# Altium schematic sheet BaseDimmerBoard.SchDoc
size 420 x 297 mm; TechControlBy: {Т.контроль}; StandartControlBy: {Н.котроль}; Letter1: {Э}; DocumentType: Схема электрическая принципиальная; Title1: {Наименование}; Title2: {Наименование}; GroupNumber: {XXXX.000000.001-01}; Title3: {Наименование}; PageSetup: Record=PageOptions|CenterHorizontal=True|CenterVertical=True|PrintScale=0.95|XCorrection=1.00|YCorrection=1.00|PrintKind=2|BorderSize=5000000|LeftOffset=0|BottomOffset=0|Orientation=1|PaperLength=1000|PaperWidth=1000|Scale=100|PaperSource=7|PrintQuality=-3|MediaType=1|DitherType=10|PrintScaleMode=1|PaperKind=A4|PaperIndex=9; DocumentNumber: 1; SheetTotal: 1
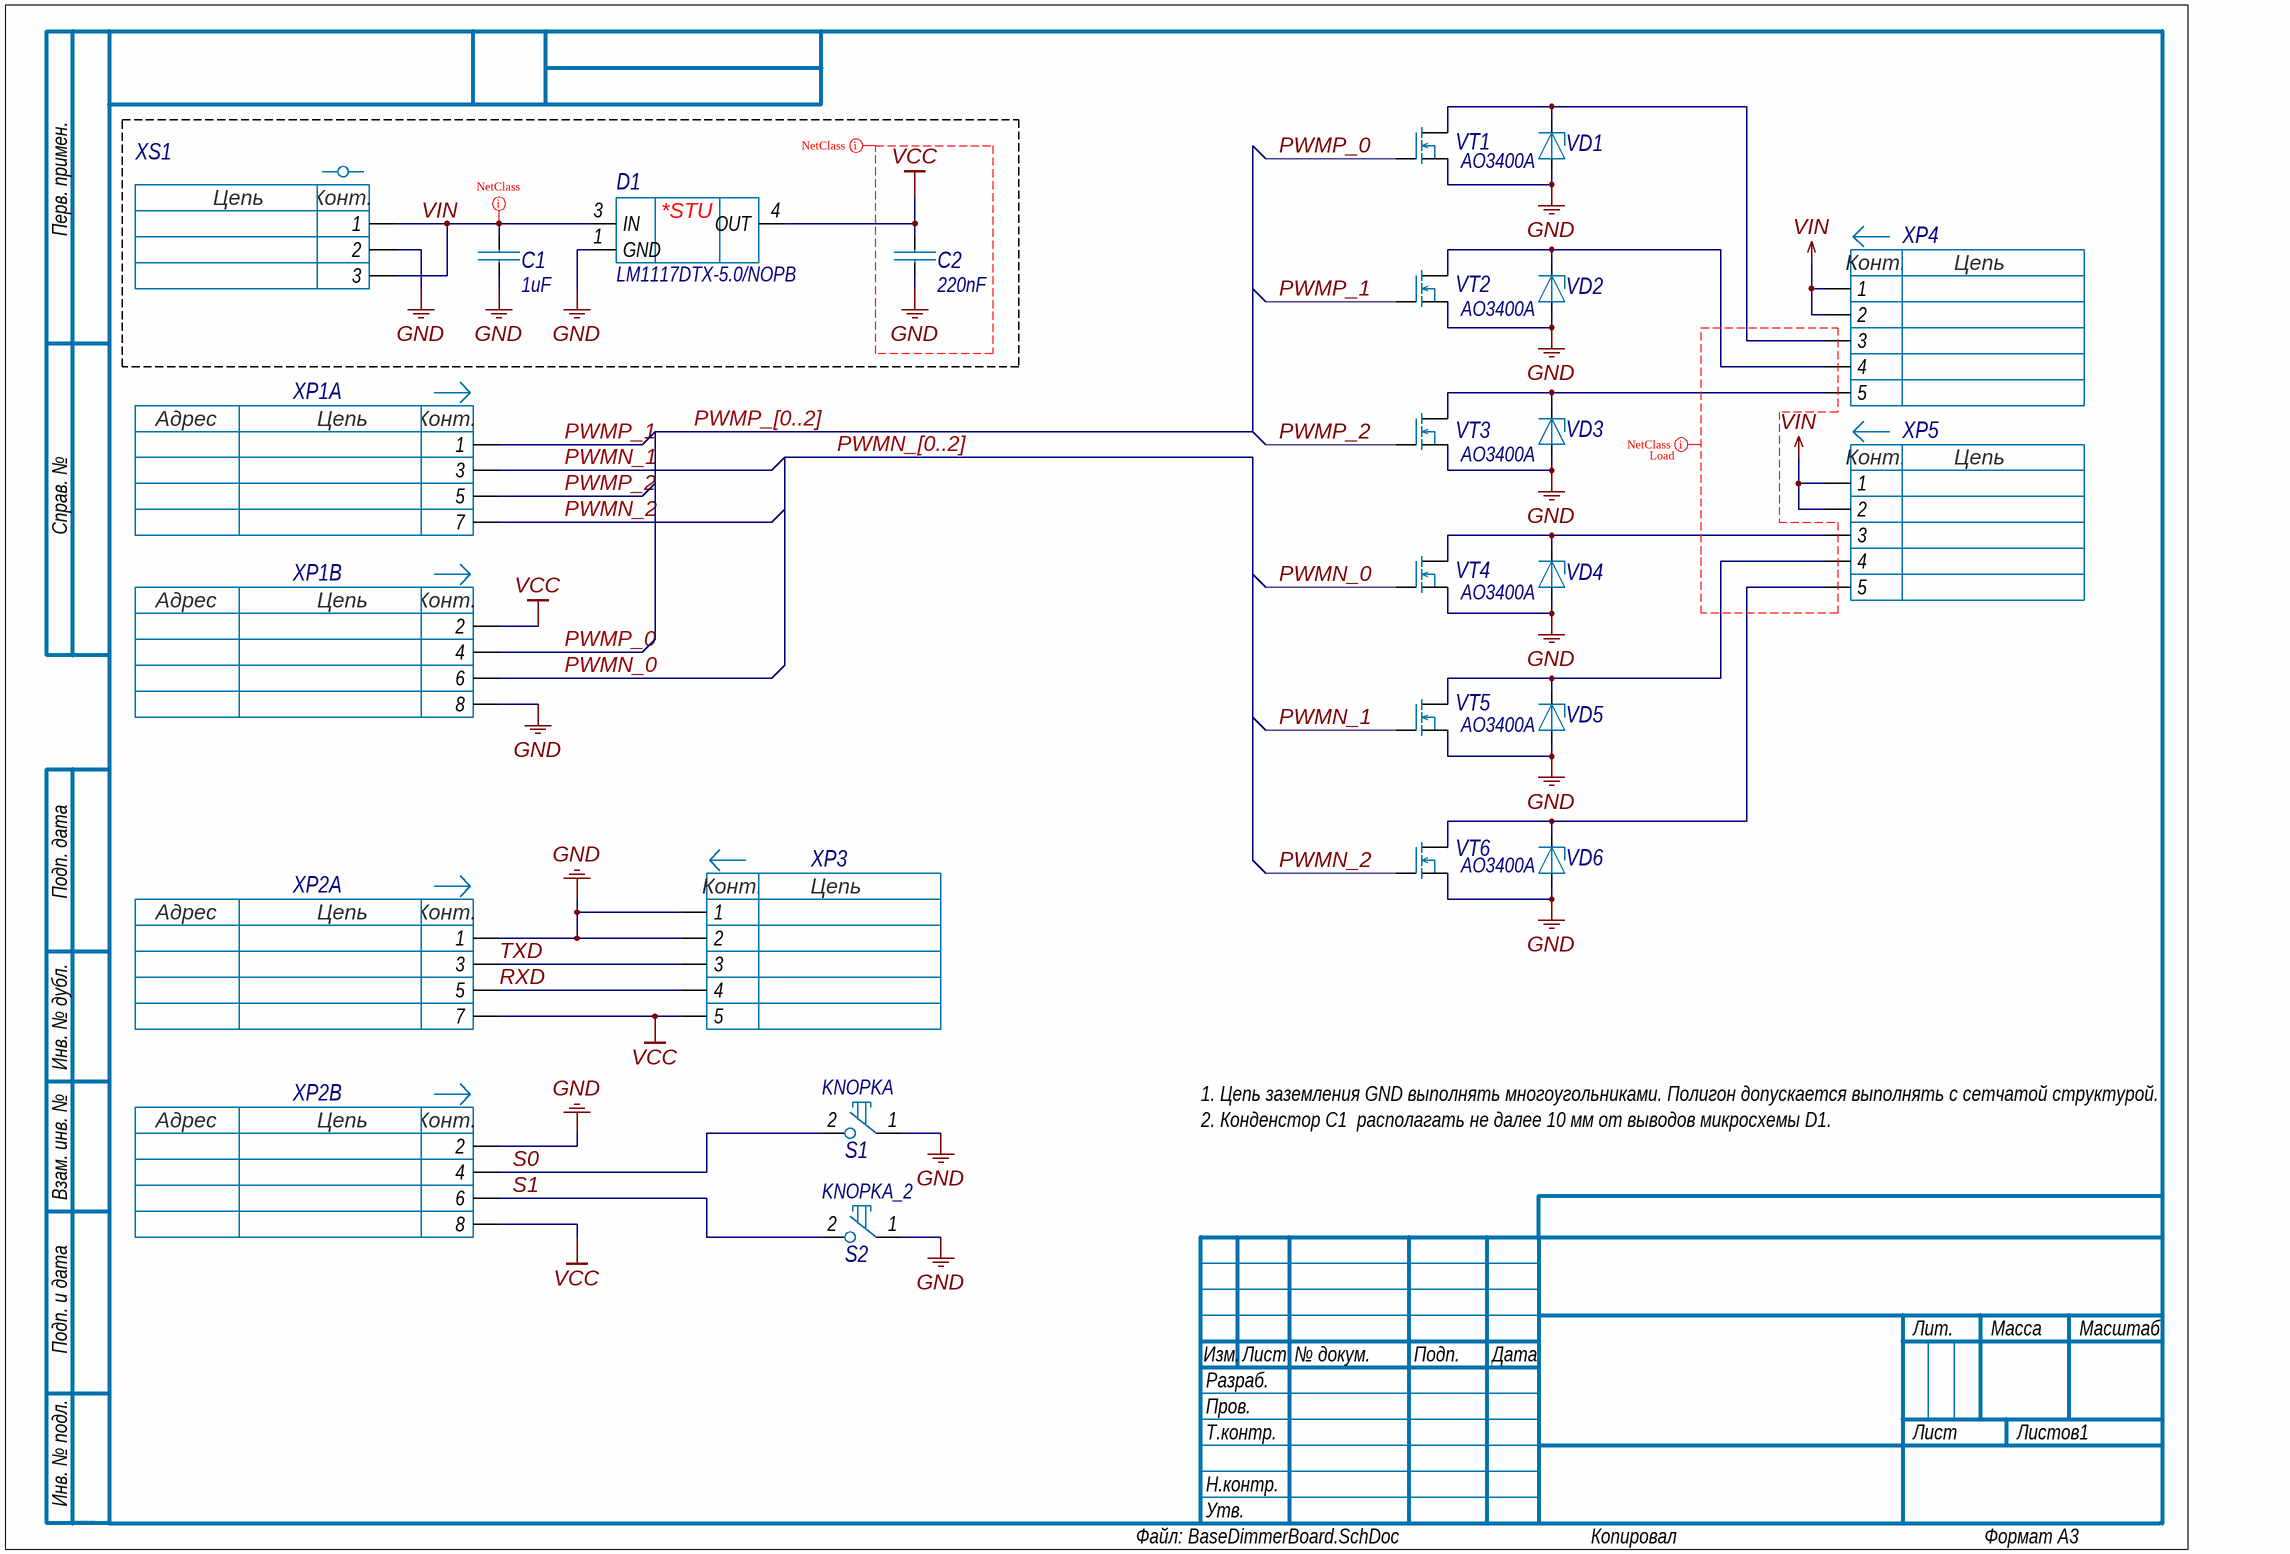
[diagram p0: BaseDimmerBoard.SchDoc]

## Parts
C1  value 1uF  [CAPC1825(4564)220_N]  (hidden comment: 1825 1 uF 25 V ±10 %  X7R)
C2  value 220nF  [CAPC0805(2012)100_N]  (hidden comment: 220nF 6.3V 0805(2012))
D1  LM1117DTX-5.0/NOPB  [NDP0003B_L]
S1  KNOPKA  [ELASTO_5.08MM]
S2  KNOPKA_2  [DOME_SQ04200N]
VD1  P6SMB27AT3G  [ONSC-SMB-2-403A-03_J_V]  (value not drawn)
VD2  P6SMB27AT3G  [ONSC-SMB-2-403A-03_J_V]  (value not drawn)
VD3  P6SMB27AT3G  [ONSC-SMB-2-403A-03_J_V]  (value not drawn)
VD4  P6SMB27AT3G  [ONSC-SMB-2-403A-03_J_V]  (value not drawn)
VD5  P6SMB27AT3G  [ONSC-SMB-2-403A-03_J_V]  (value not drawn)
VD6  P6SMB27AT3G  [ONSC-SMB-2-403A-03_J_V]  (value not drawn)
VT1  AO3400A  [AO-SOT23-3_V]
VT2  AO3400A  [AO-SOT23-3_V]
VT3  AO3400A  [AO-SOT23-3_V]
VT4  AO3400A  [AO-SOT23-3_V]
VT5  AO3400A  [AO-SOT23-3_V]
VT6  AO3400A  [AO-SOT23-3_V]
XP1  TSM-104-04-T-DV  [TSM-104-04-T-DV]  (value not drawn)  (parts A,B of 2)
XP2  TSM-104-04-T-DV  [TSM-104-04-T-DV]  (value not drawn)  (parts A,B of 2)
XP3  TSW-105-05-T-S  [SMTC-TSW-105-05-X-S]  (value not drawn)
XP4  TSW-105-05-T-S  [SMTC-TSW-105-05-X-S]  (value not drawn)
XP5  TSW-105-05-T-S  [SMTC-TSW-105-05-X-S]  (value not drawn)
XS1  691213710003  [ETB15-3]  (value not drawn)

## Nets
GND: C1.2 C2.1 D1.1(GND) S1.1 S2.1 VD1.2 VD2.2 VD3.2 VD4.2 VD5.2 VD6.2 VT1.S VT2.S VT3.S VT4.S VT5.S VT6.S XP1.8 XP2.1 XP2.2 XP3.1 XP3.2 XS1.2
VCC: C2.2 D1.4(OUT) XP1.2 XP2.7 XP2.8 XP3.5
VIN: C1.1 D1.3(IN) XP4.1 XP4.2 XP5.1 XP5.2 XS1.1 XS1.3
PWMN_0: VT4.G XP1.6
PWMN_1: VT5.G XP1.3
PWMN_2: VT6.G XP1.7
PWMP_0: VT1.G XP1.4
PWMP_1: VT2.G XP1.1
PWMP_2: VT3.G XP1.5
RXD: XP2.5 XP3.4
S0: S1.2 XP2.4
S1: S2.2 XP2.6
TXD: XP2.3 XP3.3
NetVD1_1: VD1.1 VT1.D XP4.3
NetVD2_1: VD2.1 VT2.D XP4.4
NetVD3_1: VD3.1 VT3.D XP4.5
NetVD4_1: VD4.1 VT4.D XP5.3
NetVD5_1: VD5.1 VT5.D XP5.4
NetVD6_1: VD6.1 VT6.D XP5.5

## Buses and harness runs
bus PWMN_[0..2]
bus PWMP_[0..2]

## Layout directives
net class Power: GND, VCC, VIN
net class Load: VIN

## Notes on the sheet
- Функциональная группа стабилизатора напряжения
- 1. Цепь заземления GND выполнять многоугольниками. Полигон допускается выполнять с сетчатой структурой.
- 2. Конденстор C1  располагать не далее 10 мм от выводов микросхемы D1.
- Перв. примен.
- Справ. №
- Подп. дата
- Инв. № дубл.
- Взам. инв. №
- Подп. и дата
- Изм.
- Разраб.
- Лист
- № докум.
- Подп.
- Дата
- Лит.
- Масса
- Масштаб
- Пров.
- Т.контр.
- Листов
- Инв. № подл.
- Н.контр.
- Утв.
- ALTIUM GOSTBOM2.0 KEV
- Файл:
- Копировал
- Формат А3
- (in symbol 691213710003) Цепь; Конт.
- (in symbol LM1117DTX-5.0/NOPB) *STU
- (in symbol TSM-104-04-T-DV, part A) Адрес; Цепь; Конт.
- (in symbol TSM-104-04-T-DV, part B) Адрес; Цепь; Конт.
- (in symbol TSW-105-05-T-S) Конт.; Цепь

## Library data of the parts
C1 = VJ1825Y105KXXAT: Керамический чип-конденсатор; Manufacturer: Vishay; Tolerance: 10%; Voltage Rating (DC): 25V; Mount: Surface Mount; Case/Package: 1825; Min Operating Temperature: -55°C; Max Operating Temperature: 150°C; Dielectric: X7R; Voltage Rating: 25V; Length: 4.5mm; Depth: 6.4mm; Lead Free: Lead Free; ComponentLink2URL: http://datasheet.octopart.com/VJ1825Y105KXXAT-Vishay-datasheet-14932079.pdf; ComponentLink2Description: http://datasheet.octopart.com/VJ1825Y105KXXAT-Vishay-datasheet-14932079.pdf; Stock 1: 0; Supplier 1: Avnet; Supplier Part Number 1: VJ1825Y105KXXAT; ClassName: Stabilizer; Manufacturer Part Number: VJ1825Y105KXXAT
C2 = LLM215R70J224MA11L: Керамический чип-конденсатор; Manufacturer: Murata; Tolerance: 20%; Dielectric: X7R; Mount: Surface Mount; Case/Package: 0805; Case Code (Metric): 2012; Case Code (Imperial): 0805; Min Operating Temperature: -55°C; Max Operating Temperature: 125°C; Package Quantity: 1; Voltage Rating: 6.3V; Packaging: Tape and Reel; Termination: SMD/SMT; Voltage Rating (DC): 6.3V; Length: 2mm; Height: 0.5mm; Width: 0.049inch; Thickness: 0.022inch; Depth: 1.25mm; Radiation Hardening: No; Lead Free: Lead Free; ComponentLink9URL: http://datasheet.octopart.com/LLM215R70J224MA11L-Murata-datasheet-11978611.pdf; ComponentLink9Description: http://datasheet.octopart.com/LLM215R70J224MA11L-Murata-datasheet-11978611.pdf; Stock 1: 3598; Supplier 1: Mouser; Supplier Part Number 1: 81-LLM215R70J224MA1L; ClassName: Stabilizer; Manufacturer Part Number: LLM215R70J224MA11L
D1 = LM1117DTX-5.0/NOPB: LDO Regulator Pos 5V 0.8A 3-Pin(2+Tab) TO-252 T/R; Manufacturer: TI National Semiconductor; Quiescent Current: 10mA; Dropout Voltage: 1.2V; Max Input Voltage: 15V; Output Current: 800mA; Number of Outputs: 1; Polarity: Positive; Output Type: Fixed; Accuracy: 1%; Mount: Surface Mount; Case/Package: TO-252; Number of Pins: 3; Contact Plating: Tin; Min Operating Temperature: -40°C; Max Operating Temperature: 125°C; Output Voltage: 5V; Packaging: Tape and Reel; Max Output Current: 800mA; Package Quantity: 2500; Number of Regulators: 1; Min Current Limit: 800mA; Nominal Output Voltage: 5V; Output Voltage Accuracy: 1%; Radiation Hardening: No; Lead Free: Lead Free; REACH SVHC: No SVHC; ComponentLink1URL: https://datasheet.ciiva.com/39121/1280534-39121523.pdf?src-supplier=Jameco; ComponentLink1Description: https://datasheet.ciiva.com/39121/1280534-39121523.pdf?src-supplier=Jameco; Stock 1: 2500; Supplier 1: Arrow; Supplier Part Number 1: LM1117DTX-5.0/NOPB; Manufacturer Part Number: LM1117DTX-5.0/NOPB; ClassName: Stabilizer
S1 = KNOPKA: Manufacturer Part Number: Сенсор
S2 = KNOPKA_2: Manufacturer Part Number: Сенсор
VD1-VD6 = P6SMB27AT3G: TVS DIODE 23.1V 37.5V SMB; Manufacturer: ON Semiconductor; Breakdown Voltage: 27V; Max Surge Current: 16A; Reverse Breakdown Voltage: 25.7V; Number of Elements: 1; Direction: Unidirectional; Peak Pulse Power: 600W; Power Line Protection: No; Max Reverse Leakage Current: 5uA; Test Current: 1mA; ESD Protection: Yes; Element Configuration: Single; Max Breakdown Voltage: 28.4V; Case/Package: SMB; Number of Pins: 2; Contact Plating: Tin; Min Operating Temperature: -65°C; Max Operating Temperature: 150°C; Packaging: Tape and Reel; Package Quantity: 1; Operating Supply Voltage: 23.1V; Clamping Voltage: 37.5V; Polarity: Unidirectional; Number of Unidirectional Channels: 1; Reverse Standoff Voltage: 23.1V; Min Breakdown Voltage: 25.7V; Peak Pulse Current: 16A; Leakage Current: 5uA; Power Dissipation: 600W; Voltage Rating (DC): 27V; Current Rating: 16A; Composition: Zener; Number of Channels: 1; Termination: SMD/SMT; Length: 4.32mm; Height: 2.13mm; Width: 3.56mm; Depth: 3.56mm; Radiation Hardening: No; Lead Free: Lead Free; REACH SVHC: No SVHC; ComponentLink1URL: https://datasheet.ciiva.com/3021/p6smb6-8at3-d-3021361.pdf?src-supplier=Avnet; ComponentLink1Description: https://datasheet.ciiva.com/3021/p6smb6-8at3-d-3021361.pdf?src-supplier=Avnet; Stock 1: 0; Supplier 1: Avnet; Supplier Part Number 1: P6SMB27AT3G; Manufacturer Part Number: P6SMB27AT3G
VT1-VT6 = AO3400A: MOSFET N-CH 30V 5.7A SOT23; Manufacturer: Alpha & Omega Semiconductor; Gate to Source Voltage (Vgs): 12V; Rds On Max: 26.5mR; Input Capacitance: 630pF; Max Power Dissipation: 1.4W; Number of Elements: 1; Mount: Surface Mount; Case/Package: SOT-23; Number of Pins: 3; Min Operating Temperature: -55°C; Max Operating Temperature: 150°C; Packaging: Tape and Reel; Drain to Source Voltage (Vdss): 30V; Continuous Drain Current (ID): 5.7A; Power Dissipation: 1.4W; Radiation Hardening: No; Lead Free: Lead Free; ComponentLink1URL: https://datasheet.ciiva.com/940/ao3400a-940739.pdf?src-supplier=Digi-Key; ComponentLink1Description: https://datasheet.ciiva.com/940/ao3400a-940739.pdf?src-supplier=Digi-Key; Stock 1: 660154; Supplier 1: Digi-Key; Supplier Part Number 1: 785-1000-1-ND; Manufacturer Part Number: AO3400A
XP1 XP2 = TSM-104-04-T-DV: SAMTEC  Board-To-Board Connector, / TSM Series, 8 Contacts, Header, 2.54 mm, / Surface Mount, 2 Rows; Manufacturer Part Number: TSM-104-04-T-DV.1; Number of Contacts: 8; Gender: Male; Pitch: 2.54mm; Mount: Surface Mount; Contact Plating: Tin; Contact Material: Bronze; Number of Rows: 2; Termination: Solder; Packaging: Bulk; Radiation Hardening: No; Lead Free: Lead Free; REACH SVHC: No SVHC; ComponentLink1URL: http://www.farnell.com/datasheets/1927672.pdf?src-supplier=Farnell; ComponentLink1Description: http://www.farnell.com/datasheets/1927672.pdf?src-supplier=Farnell; ComponentLink2URL: http://www.samtec.com/documents/webfiles/pdf/TSM.PDF?src-supplier=Avnet+Europe; ComponentLink2Description: http://www.samtec.com/documents/webfiles/pdf/TSM.PDF?src-supplier=Avnet+Europe; ComponentLink3URL: http://www.samtec.com/documents/webfiles/pdf/TSM.PDF?src-supplier=Avnet; ComponentLink3Description: http://www.samtec.com/documents/webfiles/pdf/TSM.PDF?src-supplier=Avnet; Stock 1: 283; Supplier 1: Mouser; Supplier Part Number 1: 200-TSM10404TDV; Manufacturer: Samtec
XP3-XP5 = TSW-105-05-T-S: TSW - Samtec 2.54mm Pin Header 13.46mm Overall Pin Length 5.08mm Tail (08); Number of Contacts: 10; Gender: Male; Max Current Rating: 7.6A; Max Voltage Rating (AC): 550V; Connector Type: Male Pin; Row Spacing: 0.1inch; Mount: Through Hole; Contact Material: Bronze; Contact Plating: Gold; Housing Color: Black; Housing Material: Polyester; Color: Black; Min Operating Temperature: -55°C; Max Operating Temperature: 125°C; Number of Rows: 2; Packaging: Bulk; Termination: Solder; Orientation: Straight; Number of Positions: 10; Package Quantity: 1; Length: 12.7mm; Pitch: 2.54mm; Depth: 5.08mm; Contact Mating Length: 0.23inch; Width: 5.08mm; Radiation Hardening: No; Lead Free: Lead Free; ComponentLink4URL: http://datasheet.octopart.com/TSW-105-08-S-D-Samtec-datasheet-97325576.pdf?src-supplier=Samtec; ComponentLink4Description: http://datasheet.octopart.com/TSW-105-08-S-D-Samtec-datasheet-97325576.pdf?src-supplier=Samtec; Stock 1: 162; Supplier 1: Mouser; Supplier Part Number 1: 200-TSW10508SD; Manufaturer Part Number: TSW-105-05-T-S; Manufacturer Part Number: TSW-105-05-T-S; Manufacturer: Samtec
XS1 = 691213710003: TERM BLK 5MM HORZ ENTRY MOD 3P; Manufacturer: Wurht Electronics; Plating: Brass; Number of Levels: 1; Number of Positions Per Level: 3; Current: 10A; Voltage: 300V; Connector Type: PCB; Pitch: 0.197inch; Wire Gauge (Max): 26AWG; Wire Gauge (Min): 16AWG; Stripping Length: -7mm; Mount: Through Hole; Color: Green; Contact Plating: Brass; Contact Material: Brass; Housing Material: Nylon; Min Operating Temperature: -40°C; Max Operating Temperature: 105°C; Package Quantity: 1300; Packaging: Bulk; Termination: Screw; Number of Contacts: 3; Length: 8.3mm; Height: 10mm; Wire/Cable Gauge: 16AWG; Width: 15.6mm; Lead Pitch: 5mm; REACH SVHC: Unknown; ComponentLink1URL: https://datasheet.ciiva.com/824/6912137100xx-824134.pdf?src-supplier=Digi-Key; ComponentLink1Description: https://datasheet.ciiva.com/824/6912137100xx-824134.pdf?src-supplier=Digi-Key; Stock 1: 1324; Supplier Part Number 1: 732-2039-ND; Supplier 1: Digi-Key; Manufacturer Part Number: 691213710003; ClassName: Stabilizer